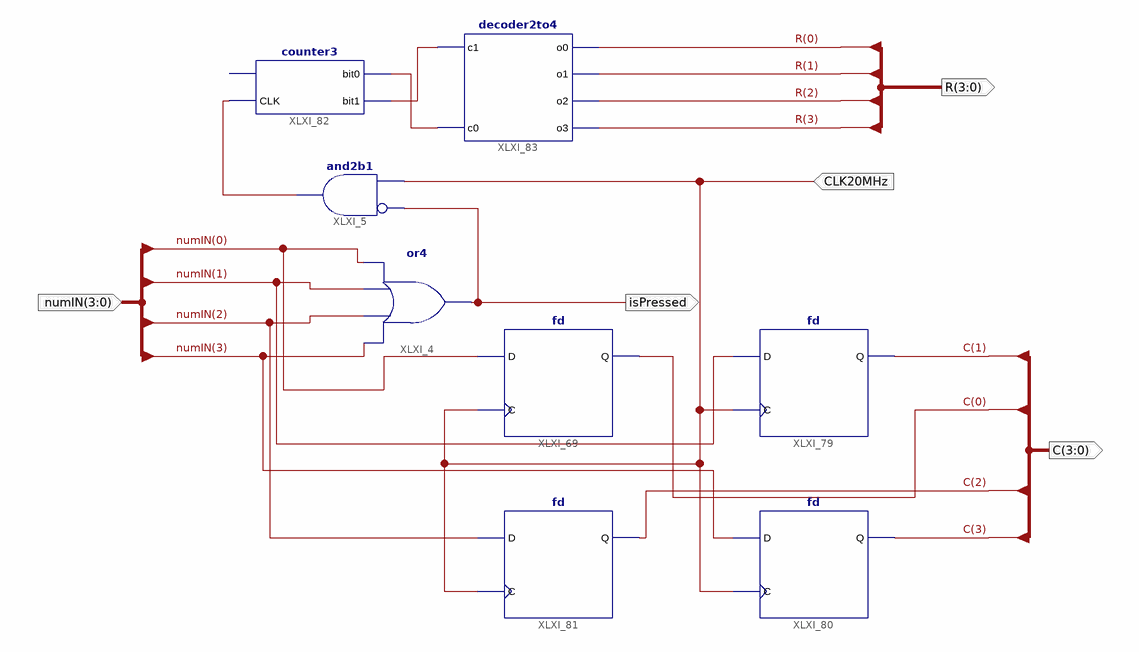
[diagram p0: schematic sheet 1]
// Xilinx ISE schematic numpad.sch (spartan6) as structural Verilog: 8 symbols, 5 ports
module numpad (
  input  CLK20MHz,
  input  [3:0] numIN,
  output isPressed,
  output [3:0] C,
  output [3:0] R
);

  wire XLXN_1, XLXN_2, XLXN_18;

  or XLXI_4 (isPressed, numIN[3], numIN[2], numIN[1], numIN[0]);
  and XLXI_5 (XLXN_18, ~isPressed, CLK20MHz);  // and2b1
  fd XLXI_69 (.C(CLK20MHz), .D(numIN[0]), .Q(C[0]));
  fd XLXI_79 (.C(CLK20MHz), .D(numIN[1]), .Q(C[1]));
  fd XLXI_80 (.C(CLK20MHz), .D(numIN[3]), .Q(C[3]));
  fd XLXI_81 (.C(CLK20MHz), .D(numIN[2]), .Q(C[2]));
  counter3 XLXI_82 (.CLK(XLXN_18), .bit0(XLXN_1), .bit1(XLXN_2));  // open: CLR
  decoder2to4 XLXI_83 (.c1(XLXN_2), .c0(XLXN_1), .o0(R[0]), .o1(R[1]), .o2(R[2]), .o3(R[3]));
endmodule
